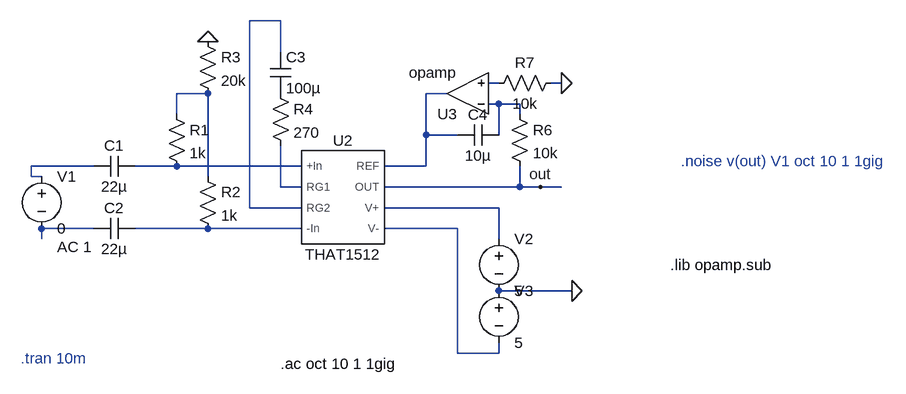
[diagram p0: schematic MIcpre.asc]
MIcpre.asc, the LTspice schematic file:
Version 4
SHEET 1 1088 680
WIRE 128 -96 80 -96
WIRE 128 -48 128 -96
WIRE 464 0 448 0
WIRE 560 0 544 0
WIRE 16 16 -32 16
WIRE 384 16 352 16
WIRE 464 32 448 32
WIRE 496 32 464 32
WIRE -32 48 -32 16
WIRE 496 48 496 32
WIRE 352 80 352 16
WIRE 400 80 352 80
WIRE 464 80 464 32
WIRE -160 128 -256 128
WIRE -32 128 -96 128
WIRE 160 128 -32 128
WIRE 352 128 352 80
WIRE 352 128 288 128
WIRE -256 144 -256 128
WIRE -240 144 -256 144
WIRE 16 144 16 16
WIRE 128 160 128 96
WIRE 160 160 128 160
WIRE 496 160 496 128
WIRE 496 160 288 160
WIRE 528 160 496 160
WIRE 560 160 528 160
WIRE 80 192 80 -96
WIRE 160 192 80 192
WIRE 464 192 288 192
WIRE -160 224 -240 224
WIRE 16 224 -96 224
WIRE 160 224 16 224
WIRE 400 224 288 224
WIRE -240 240 -240 224
WIRE 464 240 464 192
WIRE 576 320 464 320
WIRE 400 416 400 224
WIRE 464 416 464 400
WIRE 464 416 400 416
FLAG 16 -64 0
FLAG 576 320 0
FLAG 528 160 out
FLAG 560 0 0
SYMBOL voltage -240 128 R0
WINDOW 123 24 124 Left 2
WINDOW 39 0 0 Left 0
SYMATTR Value2 AC 1
SYMATTR InstName V1
SYMATTR Value 0
SYMBOL cap -96 112 R90
WINDOW 0 0 32 VBottom 2
WINDOW 3 32 32 VTop 2
SYMATTR InstName C1
SYMATTR Value 22µ
SYMBOL cap -96 208 R90
WINDOW 0 0 32 VBottom 2
WINDOW 3 32 32 VTop 2
SYMATTR InstName C2
SYMATTR Value 22µ
SYMBOL res -48 32 R0
SYMATTR InstName R1
SYMATTR Value 1k
SYMBOL res 0 128 R0
SYMATTR InstName R2
SYMATTR Value 1k
SYMBOL res 0 -80 R0
SYMATTR InstName R3
SYMATTR Value 20k
SYMBOL res 112 0 R0
SYMATTR InstName R4
SYMATTR Value 270
SYMBOL cap 112 -48 R0
SYMATTR InstName C3
SYMATTR Value 100µ
SYMBOL voltage 464 224 R0
WINDOW 123 0 0 Left 0
WINDOW 39 0 0 Left 0
SYMATTR InstName V2
SYMATTR Value 5
SYMBOL voltage 464 304 R0
WINDOW 123 0 0 Left 0
WINDOW 39 0 0 Left 0
SYMATTR InstName V3
SYMATTR Value 5
SYMBOL THAT1512 224 176 R0
SYMATTR InstName U2
SYMBOL OpAmps\\opamp 416 80 R180
SYMATTR InstName U3
SYMBOL res 480 32 R0
SYMATTR InstName R6
SYMATTR Value 10k
SYMBOL cap 464 64 R90
WINDOW 0 0 32 VBottom 2
WINDOW 3 32 32 VTop 2
SYMATTR InstName C4
SYMATTR Value 10µ
SYMBOL res 560 -16 R90
WINDOW 0 0 56 VBottom 2
WINDOW 3 32 56 VTop 2
SYMATTR InstName R7
SYMATTR Value 10k
TEXT -272 424 Left 2 ;.tran 10m
TEXT 128 432 Left 2 !.ac oct 10 1 1gig
TEXT 728 280 Left 2 !.lib opamp.sub
TEXT 744 120 Left 2 ;.noise v(out) V1 oct 10 1 1gig

The netlist it stands for:
* MIcpre.asc
V1 N006 N010 0 AC 1
C1 N007 N006 22µ
C2 N011 N010 22µ
R1 N003 N007 1k
R2 N003 N011 1k
R3 0 N003 20k
R4 P001 N008 270
C3 N001 P001 100µ
V2 N009 0 5
V3 0 N012 5
XU2 N007 N008 N001 N011 N004 out N009 N012 THAT1512  ; pins +In RG1 RG2 -In REF OUT V+ V-
XU3 N005 N002 N004 opamp Aol=100K GBW=10Meg  ; pins invin noninvin out
R6 N005 out 10k
C4 N005 N004 10µ
R7 0 N002 10k
* .tran 10m
.ac oct 10 1 1gig
.lib opamp.sub
* .noise v(out) V1 oct 10 1 1gig
.lib C:\GitHub\STEVEannouncer\Spice\Models\1512_Macro_01.lib
.backanno
.end